# EasyEDA schematic SCH_Instrumentação-Eletronica.json
TITLE: Projeto Instrumentacao; REV: 2.0; Date: 2024-04-29; Sheet: 1/1; Company: UNIVAP
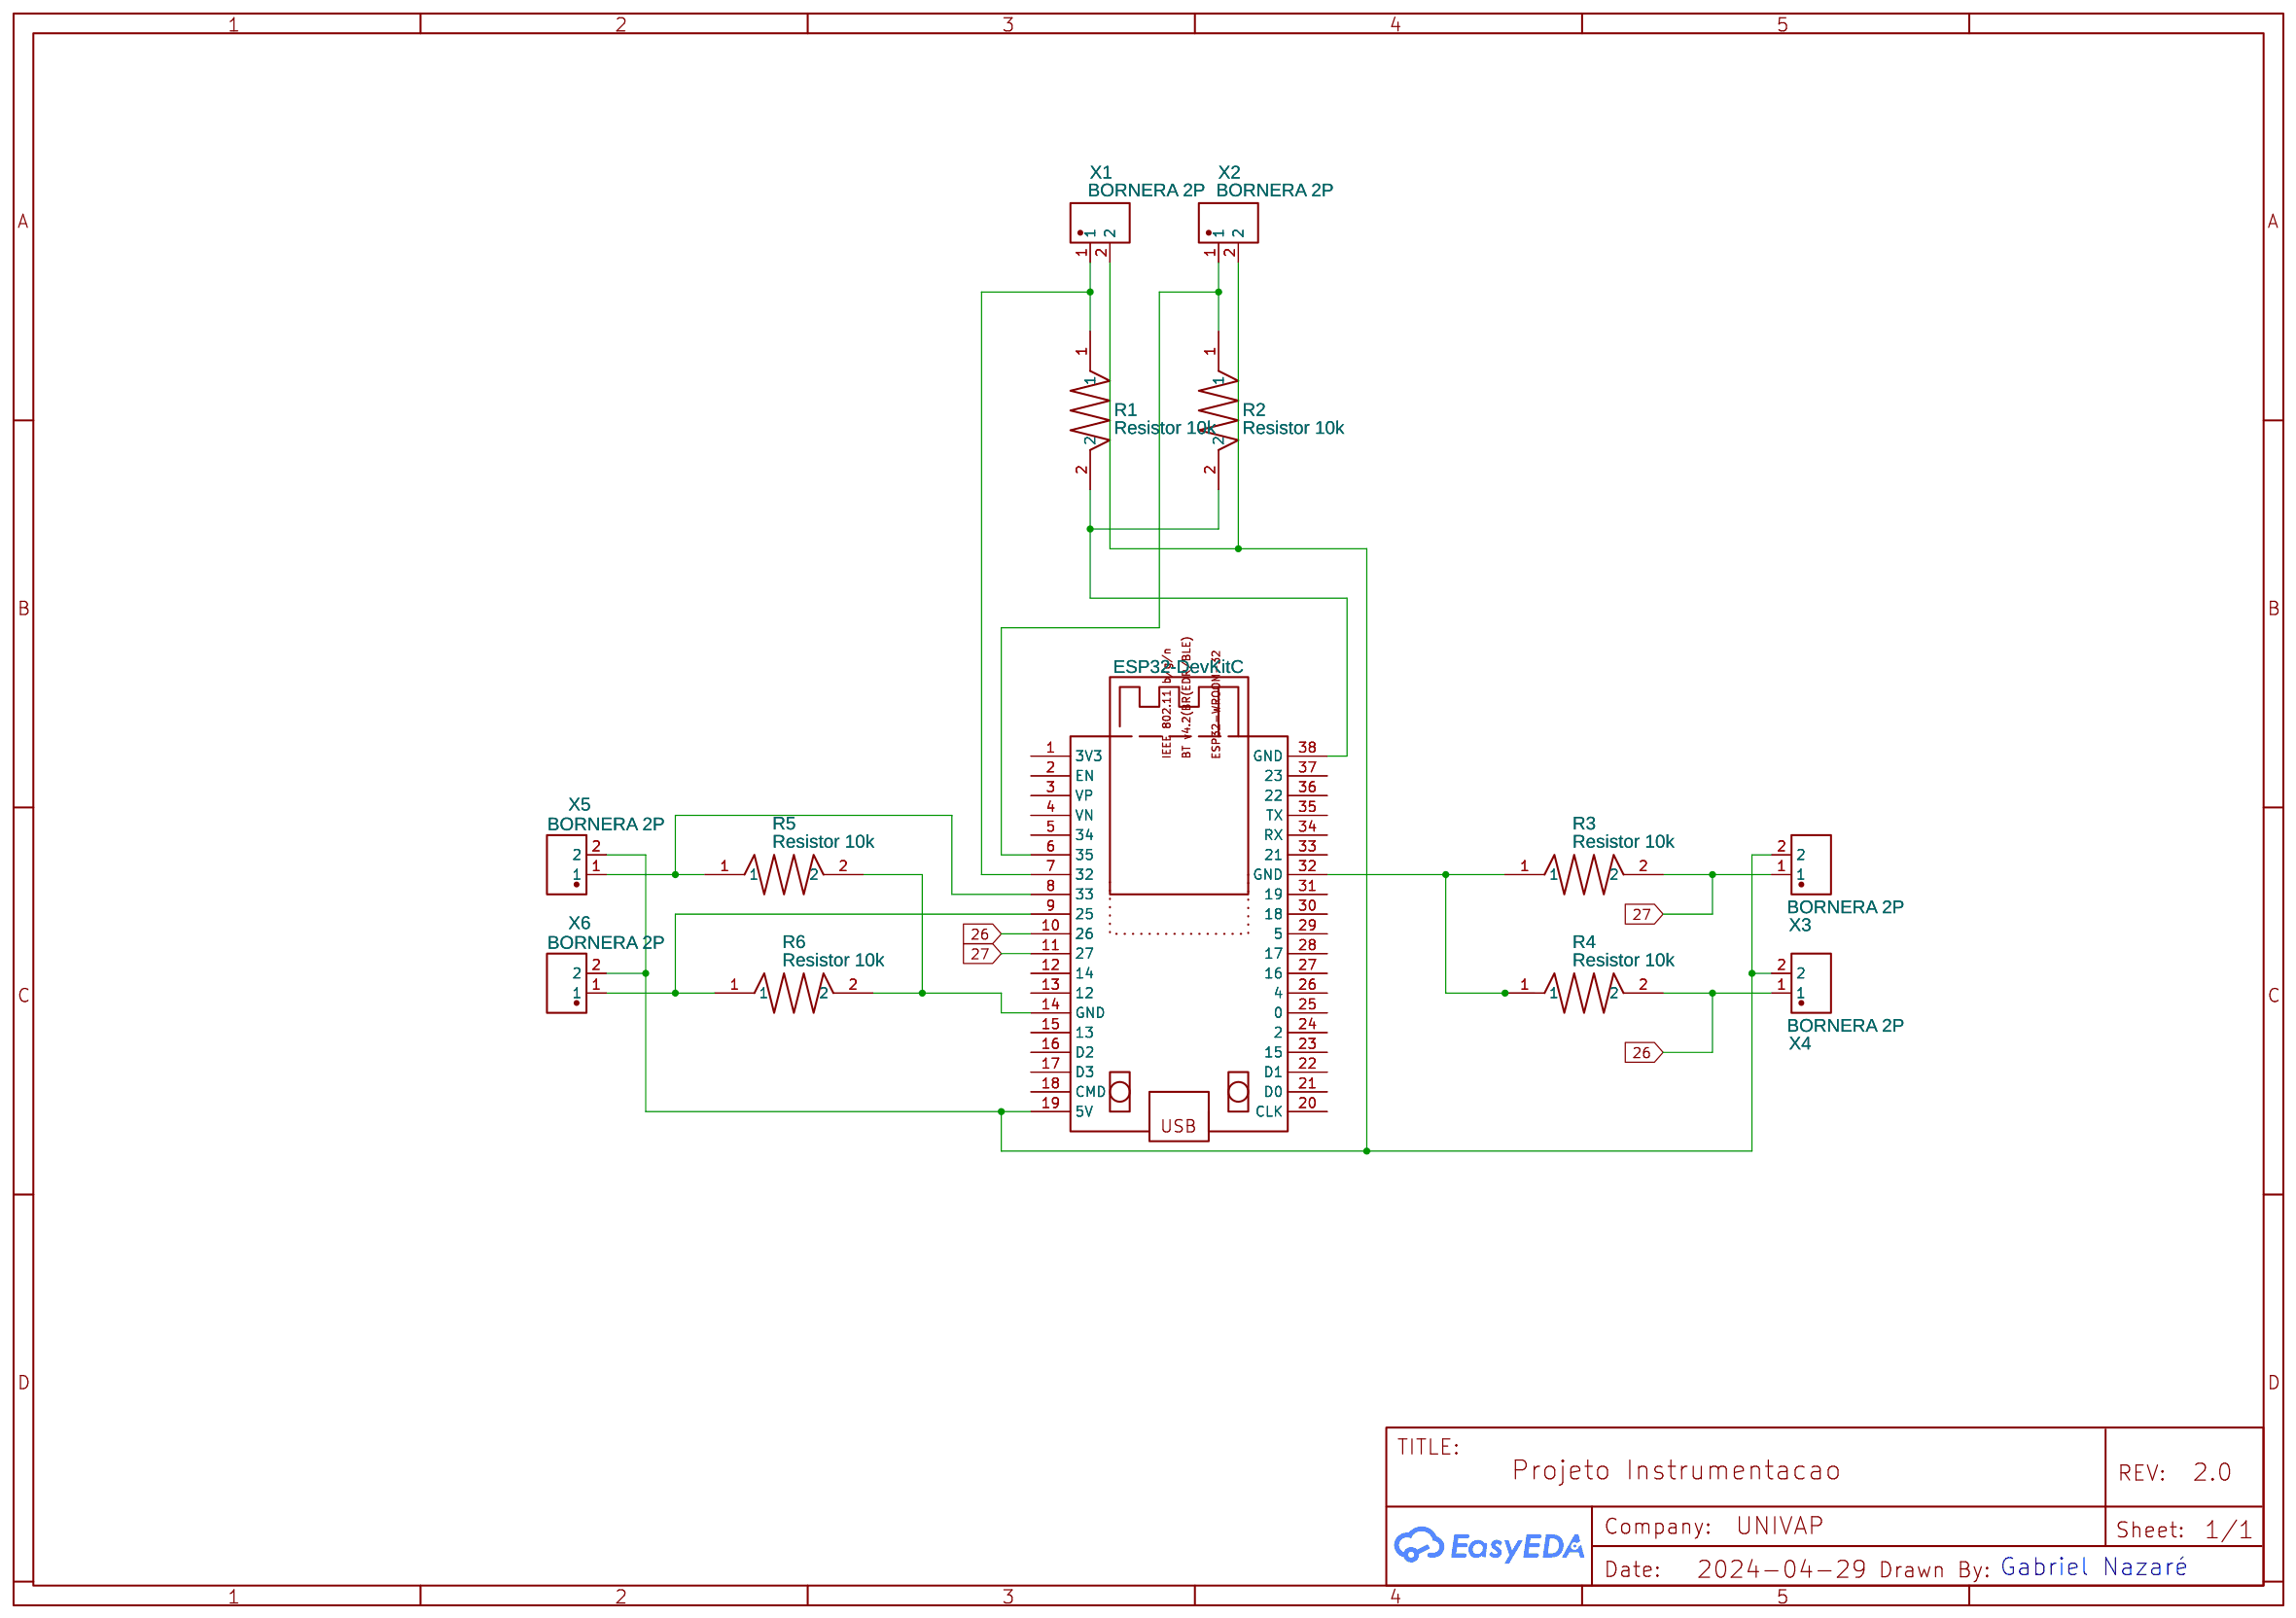
[diagram p0: schematic sheet]

## Parts
R1  Resistor 10k  [RESISTOR10K]
R2  Resistor 10k  [RESISTOR10K]
R3  Resistor 10k  [RESISTOR10K]
R4  Resistor 10k  [RESISTOR10K]
R5  Resistor 10k  [RESISTOR10K]
R6  Resistor 10k  [RESISTOR10K]
U1  ESP32-DevKitC  [ESP32DEVKITCV4]
X1  BORNERA 2P  [BORNERA 2P]
X2  BORNERA 2P  [BORNERA 2P]
X3  BORNERA 2P  [BORNERA 2P]
X4  BORNERA 2P  [BORNERA 2P]
X5  BORNERA 2P  [BORNERA 2P]
X6  BORNERA 2P  [BORNERA 2P]

## Library data of the parts
R1-R6 = Resistor 10k: Supplier: Element14; Contributor: htetaungkyaw
U1 = ESP32-DevKitC: Manufacturer: Espressif Systems; Supplier Part: C571180; Supplier: LCSC; Contributor: deliopoulos; JLCPCB Part Class: Extended Part
X1-X6 = BORNERA 2P: Supplier: Bornera; Contributor: youngjay.villegas

## Nets
26: R4.2 U1.10(26) X4.1
27: R3.2 U1.11(27) X3.1
Net-(R1-1): R1.1 U1.7(32) X1.1
Net-(R1-2): R1.2 R2.2 U1.38(GND)
Net-(R2-1): R2.1 U1.6(35) X2.1
Net-(R3-1): R3.1 R4.1 U1.32(GND)
Net-(R5-1): R5.1 U1.8(33) X5.1
Net-(R5-2): R5.2 R6.2 U1.14(GND)
Net-(R6-1): R6.1 U1.9(25) X6.1
Net-(U1-19): U1.19(5V) X1.2 X2.2 X3.2 X4.2 X5.2 X6.2

Not connected (* = marked no-connect by the designer): U1 1(3V3) 2(EN) 3(VP) 4(VN) 5(34) 12(14) 13(12) 15(13) 16(D2) 17(D3) 18(CMD) 20(CLK) 21(D0) 22(D1) 23(15) 24(2) 25(0) 26(4) 27(16) 28(17) 29(5) 30(18) 31(19) 33(21) 34(RX) 35(TX) 36(22) 37(23)

## Notes on the sheet
- Gabriel Nazaré
